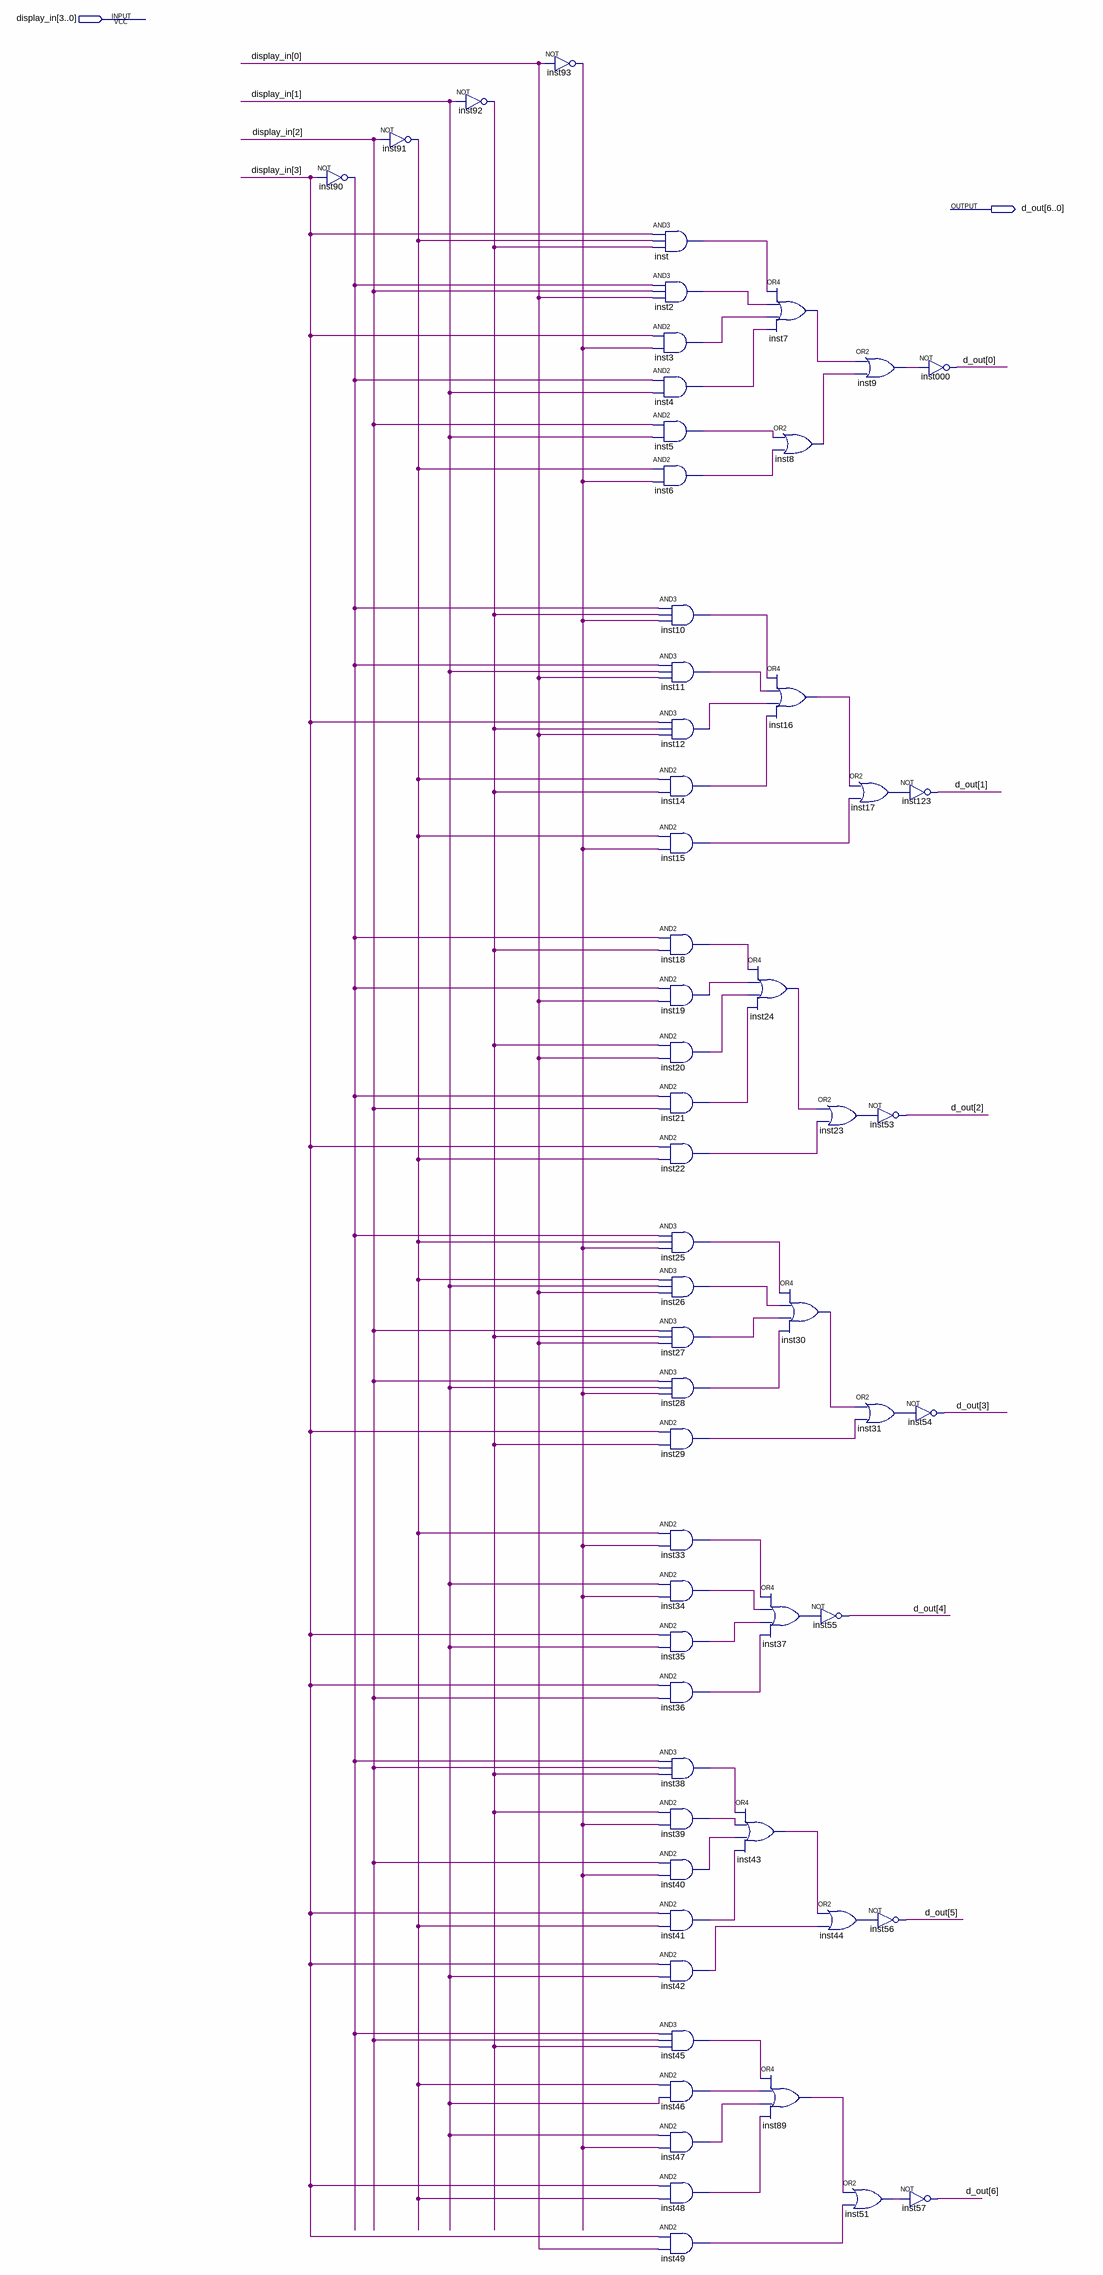
[diagram p0: schematic sheet]
// Quartus schematic display.bdf as structural Verilog: 60 symbols, 2 pins
module display (
  input  [3:0] display_in,
  output [6:0] d_out
);

  wire inst2_out, inst3_out, inst4_out, inst5_out, inst6_out, inst7_out, inst8_out, inst9_out, inst10_out,
       inst11_out, inst12_out, inst14_out, inst15_out, inst16_out, inst17_out, inst18_out, inst19_out,
       inst20_out, inst21_out, inst22_out, inst23_out, inst24_out, inst25_out, inst26_out, inst27_out,
       inst28_out, inst29_out, inst30_out, inst31_out, inst33_out, inst34_out, inst35_out, inst36_out,
       inst37_out, inst38_out, inst39_out, inst40_out, inst41_out, inst42_out, inst43_out, inst44_out,
       inst45_out, inst46_out, inst47_out, inst48_out, inst49_out, inst51_out, inst89_out, inst90_out,
       inst91_out, inst92_out, inst93_out, inst_out;

  not inst90 (inst90_out, display_in[3]);
  not inst91 (inst91_out, display_in[2]);
  not inst92 (inst92_out, display_in[1]);
  not inst93 (inst93_out, display_in[0]);
  and inst (inst_out, display_in[3], inst91_out, inst92_out);
  and inst2 (inst2_out, inst90_out, display_in[2], display_in[0]);
  and inst3 (inst3_out, display_in[3], inst93_out);
  and inst4 (inst4_out, inst90_out, display_in[1]);
  and inst5 (inst5_out, display_in[2], display_in[1]);
  and inst6 (inst6_out, inst91_out, inst93_out);
  and inst10 (inst10_out, inst90_out, inst92_out, inst93_out);
  and inst11 (inst11_out, inst90_out, display_in[1], display_in[0]);
  and inst12 (inst12_out, display_in[3], inst92_out, display_in[0]);
  and inst14 (inst14_out, inst91_out, inst92_out);
  and inst15 (inst15_out, inst91_out, inst93_out);
  and inst18 (inst18_out, inst90_out, inst92_out);
  and inst19 (inst19_out, inst90_out, display_in[0]);
  and inst20 (inst20_out, inst92_out, display_in[0]);
  and inst21 (inst21_out, inst90_out, display_in[2]);
  and inst22 (inst22_out, display_in[3], inst91_out);
  and inst25 (inst25_out, inst90_out, inst91_out, inst93_out);
  and inst26 (inst26_out, inst91_out, display_in[1], display_in[0]);
  and inst27 (inst27_out, display_in[2], inst92_out, display_in[0]);
  and inst28 (inst28_out, display_in[2], display_in[1], inst93_out);
  and inst29 (inst29_out, display_in[3], inst92_out);
  and inst33 (inst33_out, inst91_out, inst93_out);
  and inst34 (inst34_out, display_in[1], inst93_out);
  and inst35 (inst35_out, display_in[3], display_in[1]);
  and inst36 (inst36_out, display_in[3], display_in[2]);
  and inst38 (inst38_out, inst90_out, display_in[2], inst92_out);
  and inst39 (inst39_out, inst92_out, inst93_out);
  and inst40 (inst40_out, display_in[2], inst93_out);
  and inst41 (inst41_out, display_in[3], inst91_out);
  and inst42 (inst42_out, display_in[3], display_in[1]);
  and inst45 (inst45_out, inst90_out, display_in[2], inst92_out);
  and inst46 (inst46_out, inst91_out, display_in[1]);
  and inst47 (inst47_out, display_in[1], inst93_out);
  and inst48 (inst48_out, display_in[3], inst91_out);
  and inst49 (inst49_out, display_in[3], display_in[0]);
  or inst24 (inst24_out, inst18_out, inst19_out, inst20_out, inst21_out);
  or inst43 (inst43_out, inst38_out, inst39_out, inst40_out, inst41_out);
  or inst7 (inst7_out, inst_out, inst2_out, inst3_out, inst4_out);
  or inst8 (inst8_out, inst5_out, inst6_out);
  or inst16 (inst16_out, inst10_out, inst11_out, inst12_out, inst14_out);
  or inst30 (inst30_out, inst25_out, inst26_out, inst27_out, inst28_out);
  or inst37 (inst37_out, inst33_out, inst34_out, inst35_out, inst36_out);
  or inst89 (inst89_out, inst45_out, inst46_out, inst47_out, inst48_out);
  or inst17 (inst17_out, inst16_out, inst15_out);
  or inst23 (inst23_out, inst24_out, inst22_out);
  not inst55 (d_out[4], inst37_out);
  or inst44 (inst44_out, inst43_out, inst42_out);
  or inst51 (inst51_out, inst89_out, inst49_out);
  or inst9 (inst9_out, inst7_out, inst8_out);
  not inst123 (d_out[1], inst17_out);
  not inst53 (d_out[2], inst23_out);
  or inst31 (inst31_out, inst30_out, inst29_out);
  not inst56 (d_out[5], inst44_out);
  not inst57 (d_out[6], inst51_out);
  not inst000 (d_out[0], inst9_out);
  not inst54 (d_out[3], inst31_out);
endmodule
